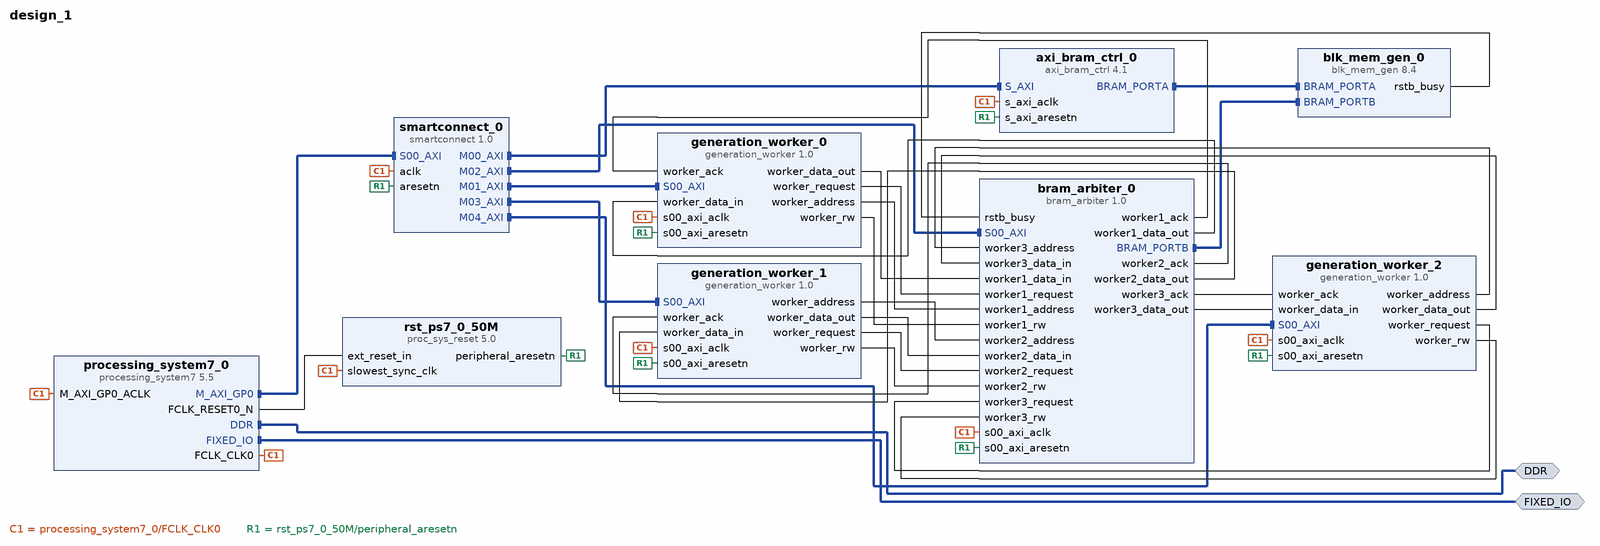
[diagram p0: block diagram of the top level]
# Vivado block design design_1, xc7z020clg400-1, Vivado 2023.1
create_bd_design design_1

create_bd_intf_port -mode Master -vlnv xilinx.com:interface:ddrx_rtl:1.0 DDR
create_bd_intf_port -mode Master -vlnv xilinx.com:display_processing_system7:fixedio_rtl:1.0 FIXED_IO

create_bd_cell -type ip -vlnv xilinx.com:ip:processing_system7:5.5 processing_system7_0
set_property -dict [list \
  CONFIG.PCW_APU_PERIPHERAL_FREQMHZ 666.666666 \
  CONFIG.PCW_ENET0_ENET0_IO {MIO 16 .. 27} \
  CONFIG.PCW_ENET0_GRP_MDIO_ENABLE 1 \
  CONFIG.PCW_ENET0_GRP_MDIO_IO {MIO 52 .. 53} \
  CONFIG.PCW_ENET0_PERIPHERAL_ENABLE 1 \
  CONFIG.PCW_ENET0_RESET_ENABLE 0 \
  CONFIG.PCW_ENET_RESET_ENABLE 1 \
  CONFIG.PCW_ENET_RESET_SELECT {Share reset pin} \
  CONFIG.PCW_GPIO_MIO_GPIO_ENABLE 1 \
  CONFIG.PCW_GPIO_MIO_GPIO_IO MIO \
  CONFIG.PCW_I2C_RESET_ENABLE 1 \
  CONFIG.PCW_PRESET_BANK1_VOLTAGE {LVCMOS 1.8V} \
  CONFIG.PCW_QSPI_GRP_FBCLK_ENABLE 1 \
  CONFIG.PCW_QSPI_GRP_FBCLK_IO {MIO 8} \
  CONFIG.PCW_QSPI_GRP_SINGLE_SS_ENABLE 1 \
  CONFIG.PCW_QSPI_GRP_SINGLE_SS_IO {MIO 1 .. 6} \
  CONFIG.PCW_QSPI_PERIPHERAL_ENABLE 1 \
  CONFIG.PCW_QSPI_QSPI_IO {MIO 1 .. 6} \
  CONFIG.PCW_SD0_GRP_CD_ENABLE 1 \
  CONFIG.PCW_SD0_GRP_CD_IO {MIO 47} \
  CONFIG.PCW_SD0_GRP_WP_ENABLE 0 \
  CONFIG.PCW_SD0_PERIPHERAL_ENABLE 1 \
  CONFIG.PCW_SD0_SD0_IO {MIO 40 .. 45} \
  CONFIG.PCW_SDIO_PERIPHERAL_FREQMHZ 50 \
  CONFIG.PCW_SINGLE_QSPI_DATA_MODE x4 \
  CONFIG.PCW_UART1_PERIPHERAL_ENABLE 1 \
  CONFIG.PCW_UART1_UART1_IO {MIO 48 .. 49} \
  CONFIG.PCW_UART_PERIPHERAL_FREQMHZ 100 \
  CONFIG.PCW_UIPARAM_DDR_FREQ_MHZ 533.333333 \
  CONFIG.PCW_UIPARAM_DDR_MEMORY_TYPE {DDR 3 (Low Voltage)} \
  CONFIG.PCW_UIPARAM_DDR_PARTNO {MT41K256M16 RE-125} \
  CONFIG.PCW_USB0_PERIPHERAL_ENABLE 1 \
  CONFIG.PCW_USB0_RESET_ENABLE 1 \
  CONFIG.PCW_USB0_RESET_IO {MIO 46} \
  CONFIG.PCW_USB0_USB0_IO {MIO 28 .. 39} \
  CONFIG.PCW_USB_RESET_ENABLE 1 \
  CONFIG.PCW_USB_RESET_SELECT {Share reset pin} \
] [get_bd_cells processing_system7_0]
# 296 more settings of processing_system7_0 are not shown: defaults, MIO pin electricals, DDR timing, and values the tool derives
create_bd_cell -type ip -vlnv xilinx.com:ip:axi_bram_ctrl:4.1 axi_bram_ctrl_0
set_property -dict [list \
  CONFIG.PROTOCOL AXI4LITE \
  CONFIG.RD_CMD_OPTIMIZATION 0 \
  CONFIG.SINGLE_PORT_BRAM 1 \
  CONFIG.USE_ECC 0 \
] [get_bd_cells axi_bram_ctrl_0]
create_bd_cell -type ip -vlnv xilinx.com:ip:blk_mem_gen:8.4 blk_mem_gen_0
set_property -dict {CONFIG.EN_SAFETY_CKT true CONFIG.Memory_Type True_Dual_Port_RAM} [get_bd_cells blk_mem_gen_0]
create_bd_cell -type ip -vlnv xilinx.com:ip:smartconnect:1.0 smartconnect_0
set_property -dict {CONFIG.NUM_MI 5 CONFIG.NUM_SI 1} [get_bd_cells smartconnect_0]
create_bd_cell -type ip -vlnv xilinx.com:ip:proc_sys_reset:5.0 rst_ps7_0_50M
create_bd_cell -type ip -vlnv user.org:user:generation_worker:1.0 generation_worker_0
create_bd_cell -type ip -vlnv user.org:user:generation_worker:1.0 generation_worker_1
create_bd_cell -type ip -vlnv user.org:user:generation_worker:1.0 generation_worker_2
create_bd_cell -type ip -vlnv user.org:user:bram_arbiter:1.0 bram_arbiter_0

# ---- connections ----

connect_bd_intf_net [get_bd_intf_pins axi_bram_ctrl_0/BRAM_PORTA] [get_bd_intf_pins blk_mem_gen_0/BRAM_PORTA]
connect_bd_intf_net [get_bd_intf_pins blk_mem_gen_0/BRAM_PORTB] [get_bd_intf_pins bram_arbiter_0/BRAM_PORTB]
connect_bd_intf_net [get_bd_intf_ports DDR] [get_bd_intf_pins processing_system7_0/DDR]
connect_bd_intf_net [get_bd_intf_ports FIXED_IO] [get_bd_intf_pins processing_system7_0/FIXED_IO]
connect_bd_intf_net [get_bd_intf_pins processing_system7_0/M_AXI_GP0] [get_bd_intf_pins smartconnect_0/S00_AXI]
connect_bd_intf_net [get_bd_intf_pins axi_bram_ctrl_0/S_AXI] [get_bd_intf_pins smartconnect_0/M00_AXI]
connect_bd_intf_net [get_bd_intf_pins generation_worker_0/S00_AXI] [get_bd_intf_pins smartconnect_0/M01_AXI]
connect_bd_intf_net [get_bd_intf_pins smartconnect_0/M02_AXI] [get_bd_intf_pins bram_arbiter_0/S00_AXI]
connect_bd_intf_net [get_bd_intf_pins smartconnect_0/M03_AXI] [get_bd_intf_pins generation_worker_1/S00_AXI]
connect_bd_intf_net [get_bd_intf_pins smartconnect_0/M04_AXI] [get_bd_intf_pins generation_worker_2/S00_AXI]
connect_bd_net [get_bd_pins blk_mem_gen_0/rstb_busy] [get_bd_pins bram_arbiter_0/rstb_busy]
connect_bd_net [get_bd_pins bram_arbiter_0/worker1_ack] [get_bd_pins generation_worker_0/worker_ack]
connect_bd_net [get_bd_pins bram_arbiter_0/worker1_data_out] [get_bd_pins generation_worker_0/worker_data_in]
connect_bd_net [get_bd_pins bram_arbiter_0/worker2_ack] [get_bd_pins generation_worker_1/worker_ack]
connect_bd_net [get_bd_pins bram_arbiter_0/worker2_data_out] [get_bd_pins generation_worker_1/worker_data_in]
connect_bd_net [get_bd_pins bram_arbiter_0/worker3_ack] [get_bd_pins generation_worker_2/worker_ack]
connect_bd_net [get_bd_pins bram_arbiter_0/worker3_data_out] [get_bd_pins generation_worker_2/worker_data_in]
connect_bd_net -net generation_worker_0_worker1_data_out [get_bd_pins generation_worker_0/worker_data_out] \
  [get_bd_pins bram_arbiter_0/worker1_data_in]
connect_bd_net -net generation_worker_0_worker1_request [get_bd_pins generation_worker_0/worker_request] [get_bd_pins bram_arbiter_0/worker1_request]
connect_bd_net [get_bd_pins generation_worker_0/worker_address] [get_bd_pins bram_arbiter_0/worker1_address]
connect_bd_net [get_bd_pins generation_worker_0/worker_rw] [get_bd_pins bram_arbiter_0/worker1_rw]
connect_bd_net [get_bd_pins generation_worker_1/worker_address] [get_bd_pins bram_arbiter_0/worker2_address]
connect_bd_net [get_bd_pins generation_worker_1/worker_data_out] [get_bd_pins bram_arbiter_0/worker2_data_in]
connect_bd_net [get_bd_pins generation_worker_1/worker_request] [get_bd_pins bram_arbiter_0/worker2_request]
connect_bd_net [get_bd_pins generation_worker_1/worker_rw] [get_bd_pins bram_arbiter_0/worker2_rw]
connect_bd_net [get_bd_pins generation_worker_2/worker_address] [get_bd_pins bram_arbiter_0/worker3_address]
connect_bd_net [get_bd_pins generation_worker_2/worker_data_out] [get_bd_pins bram_arbiter_0/worker3_data_in]
connect_bd_net [get_bd_pins generation_worker_2/worker_request] [get_bd_pins bram_arbiter_0/worker3_request]
connect_bd_net [get_bd_pins generation_worker_2/worker_rw] [get_bd_pins bram_arbiter_0/worker3_rw]
connect_bd_net [get_bd_pins processing_system7_0/FCLK_CLK0] \
  [get_bd_pins axi_bram_ctrl_0/s_axi_aclk] [get_bd_pins smartconnect_0/aclk] [get_bd_pins rst_ps7_0_50M/slowest_sync_clk] \
  [get_bd_pins processing_system7_0/M_AXI_GP0_ACLK] [get_bd_pins generation_worker_0/s00_axi_aclk] \
  [get_bd_pins generation_worker_1/s00_axi_aclk] [get_bd_pins generation_worker_2/s00_axi_aclk] \
  [get_bd_pins bram_arbiter_0/s00_axi_aclk]
connect_bd_net [get_bd_pins processing_system7_0/FCLK_RESET0_N] [get_bd_pins rst_ps7_0_50M/ext_reset_in]
connect_bd_net [get_bd_pins rst_ps7_0_50M/peripheral_aresetn] \
  [get_bd_pins axi_bram_ctrl_0/s_axi_aresetn] [get_bd_pins smartconnect_0/aresetn] \
  [get_bd_pins generation_worker_0/s00_axi_aresetn] [get_bd_pins generation_worker_1/s00_axi_aresetn] \
  [get_bd_pins generation_worker_2/s00_axi_aresetn] [get_bd_pins bram_arbiter_0/s00_axi_aresetn]
set_property HDL_ATTRIBUTE.BMM_INFO_PROCESSOR {arm > design_1 axi_bram_ctrl_0} [get_bd_cells processing_system7_0]
set_property HDL_ATTRIBUTE.KEEP_HIERARCHY yes [get_bd_cells processing_system7_0]
set_property HDL_ATTRIBUTE.BMM_INFO_ADDRESS_SPACE {byte  0x40000000 32 > design_1 blk_mem_gen_0} [get_bd_cells axi_bram_ctrl_0]
set_property HDL_ATTRIBUTE.KEEP_HIERARCHY yes [get_bd_cells axi_bram_ctrl_0]

# ---- address map ----
assign_bd_address -offset 0x40000000 -range 8K -target_address_space [get_bd_addr_spaces processing_system7_0/Data] [get_bd_addr_segs axi_bram_ctrl_0/S_AXI/Mem0]
assign_bd_address -offset 0x43C00000 -range 64K -target_address_space [get_bd_addr_spaces processing_system7_0/Data] [get_bd_addr_segs generation_worker_0/S00_AXI/S00_AXI_reg]
assign_bd_address -offset 0x43C10000 -range 64K -target_address_space [get_bd_addr_spaces processing_system7_0/Data] [get_bd_addr_segs bram_arbiter_0/S00_AXI/S00_AXI_reg]
assign_bd_address -offset 0x43C20000 -range 64K -target_address_space [get_bd_addr_spaces processing_system7_0/Data] [get_bd_addr_segs generation_worker_1/S00_AXI/S00_AXI_reg]
assign_bd_address -offset 0x43C30000 -range 64K -target_address_space [get_bd_addr_spaces processing_system7_0/Data] [get_bd_addr_segs generation_worker_2/S00_AXI/S00_AXI_reg]

set_property USER_COMMENTS.comment_3 {Worker 1} [get_bd_cells /generation_worker_0]
set_property USER_COMMENTS.comment_1 {Worker 2} [get_bd_cells /generation_worker_1]
set_property USER_COMMENTS.comment_2 {Worker 3} [get_bd_cells /generation_worker_2]

validate_bd_design
save_bd_design
